# EAGLE design PCB-ENCODER3 (EAGLE 7.1.0)
SKAARHOJ 2012 Rotary Encoder Breakout Board
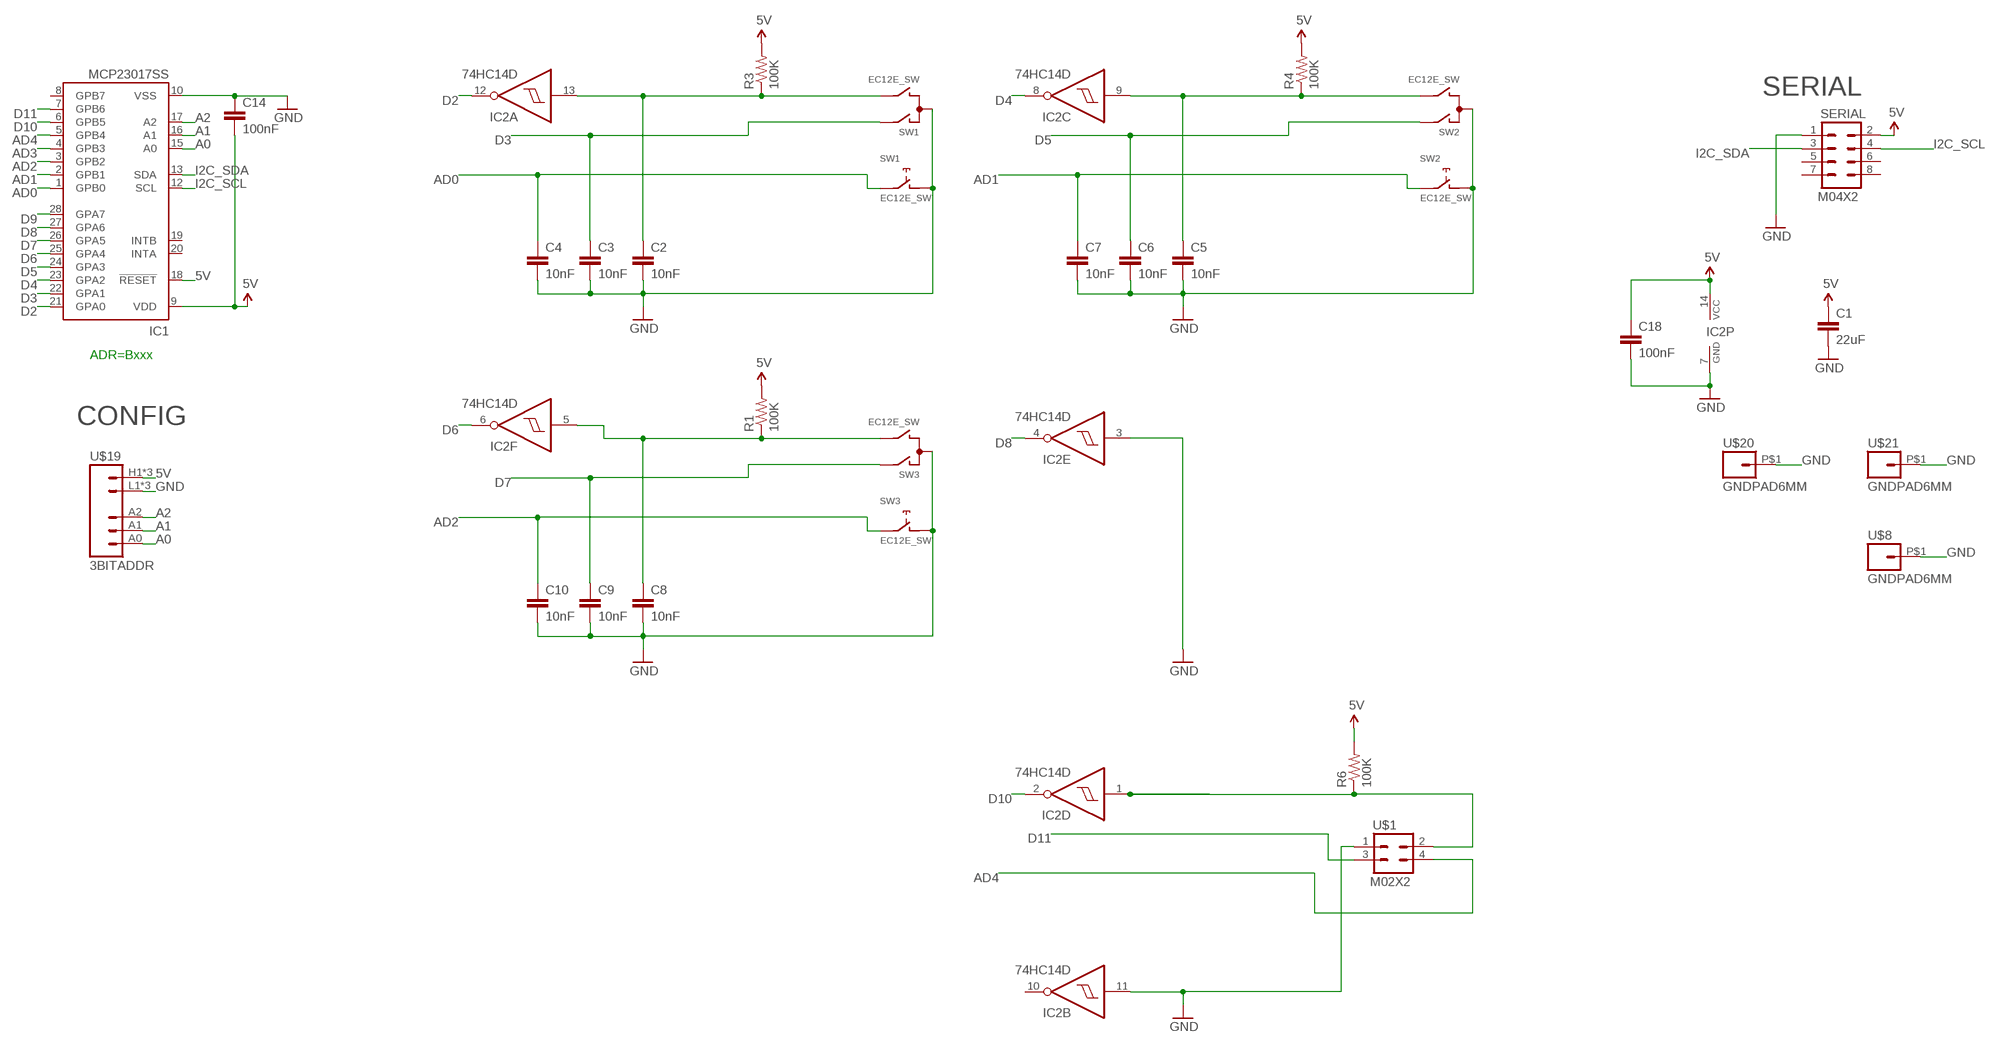
[diagram p0: schematic, sheet 1]

## Parts
C1  22uF  CAP0805  [0805]
C2  10nF  CAP0603-CAP  [0603-CAP]
C3  10nF  CAP0603-CAP  [0603-CAP]
C4  10nF  CAP0603-CAP  [0603-CAP]
C5  10nF  CAP0603-CAP  [0603-CAP]
C6  10nF  CAP0603-CAP  [0603-CAP]
C7  10nF  CAP0603-CAP  [0603-CAP]
C8  10nF  CAP0603-CAP  [0603-CAP]
C9  10nF  CAP0603-CAP  [0603-CAP]
C10  10nF  CAP0603-CAP  [0603-CAP]
C14  100nF  CAP0603-CAP  [0603-CAP]
C18  100nF  CAP0603-CAP  [0603-CAP]
IC1  MCP23017SS  [SSOP28]
IC2  74HC14D  [SO14]
R1  100K  RESISTOR0603-RES  [0603-RES]
R3  100K  RESISTOR0603-RES  [0603-RES]
R4  100K  RESISTOR0603-RES  [0603-RES]
R6  100K  RESISTOR0603-RES  [0603-RES]
SERIAL  M04X2  [2X4]
SW1  EC12E_SW  [ALPS_EC12E_SW]
SW2  EC12E_SW  [ALPS_EC12E_SW]
SW3  EC12E_SW  [ALPS_EC12E_SW]
U$1  M02X2  [2X2]
U$8  GNDPAD6MM  [3.2MMPAD6MM]
U$19  3BITADDR  [3BITADDR]
U$20  GNDPAD6MM  [3.2MMPAD6MM]
U$21  GNDPAD6MM  [3.2MMPAD6MM]

## Nets
5V [Power]: C1.1 C14.2 C18.1 IC1.9(VDD) IC1.18(!RESET) IC2.14(P:VCC) R1.2 R3.2 R4.2 R6.2 SERIAL.2 U$19.H1(VCC) U$19.H2(VCC) U$19.H3(VCC)
A0: IC1.15(A0) U$19.A0
A1: IC1.16(A1) U$19.A1
A2: IC1.17(A2) U$19.A2
AD0: C4.1 IC1.1(GPB0) SW1.E
AD1: C7.1 IC1.2(GPB1) SW2.E
AD2: C10.1 IC1.3(GPB2) SW3.E
AD3: IC1.4(GPB3)
AD4: IC1.5(GPB4) U$1.4
D2: IC1.21(GPA0) IC2.12(A:O)
D3: C3.1 IC1.22(GPA1) SW1.A
D4: IC1.23(GPA2) IC2.8(C:O)
D5: C6.1 IC1.24(GPA3) SW2.A
D6: IC1.25(GPA4) IC2.6(F:O)
D7: C9.1 IC1.26(GPA5) SW3.A
D8: IC1.27(GPA6) IC2.4(E:O)
D9: IC1.28(GPA7)
D10: IC1.6(GPB5) IC2.2(D:O)
D11: IC1.7(GPB6) U$1.3
GND [Power]: C1.2 C2.2 C3.2 C4.2 C5.2 C6.2 C7.2 C8.2 C9.2 C10.2 C14.1 C18.2 IC1.10(VSS) IC2.3(E:I) IC2.7(P:GND) IC2.11(B:I) SERIAL.1 SW1.C SW1.D SW2.C SW2.D SW3.C SW3.D U$1.1 U$8.P$1 U$19.L1(GND) U$19.L2(GND) U$19.L3(GND) U$20.P$1 U$21.P$1
I2C_SCL: IC1.12(SCL) SERIAL.4
I2C_SDA: IC1.13(SDA) SERIAL.3
N$2: IC2.1(D:I) R6.1 U$1.2
N$123: C8.1 IC2.5(F:I) R1.1 SW3.B
N$124: C2.1 IC2.13(A:I) R3.1 SW1.B
N$125: C5.1 IC2.9(C:I) R4.1 SW2.B
Unconnected: IC1.8(GPB7) IC1.19(INTB) IC1.20(INTA) IC2.10(B:O) SERIAL.5 SERIAL.6 SERIAL.7 SERIAL.8 SW1.GND1(G) SW1.GND2(G) SW2.GND1(G) SW2.GND2(G) SW3.GND1(G) SW3.GND2(G)

## Notes on the sheet
- SERIAL
- ADR=Bxxx
- CONFIG

## Library data of the parts
C1-C10 C14 C18 = SparkFun:CAP: Capacitor Standard 0603 ceramic capacitor, and 0.1" leaded capacitor.
IC1 = microchip:MCP23017: http://ww1.microchip.com/downloads/en/DeviceDoc/21952a.pdf Source: http://ww1.microchip.com/downloads/en/DeviceDoc/21952a.pdf; MF: MICROCHIP; MPN: MCP23017-E/SS; OC_FARNELL: 1467674; OC_NEWARK: 31K2960
IC2 = 74xx-eu:74*14: Hex schmitt trigger INVERTER
R1 R3 R4 R6 = SparkFun:RESISTOR: Resistor Basic schematic elements and footprints for 0603, 1206, and PTH resistors.
SERIAL = SparkFun:M04X2
SW1-SW3 = switch-alps:EC12E_SW: ALPS rotary Encoder EC12E series with switch; MPN: EC12E2424407; OC_FARNELL: 1520813; OC_NEWARK: 74M1068
U$1 = SKAARHOJ:M02X2
U$8 U$20 U$21 = SKAARHOJ:GNDPAD
U$19 = SKAARHOJ:3BITADDR

## Net classes
0 default: width 0.203 mm, drill 0.406 mm, clearance 0.203 mm
1 Power: width 0.254 mm, drill 0.406 mm, clearance 0.254 mm

## Board
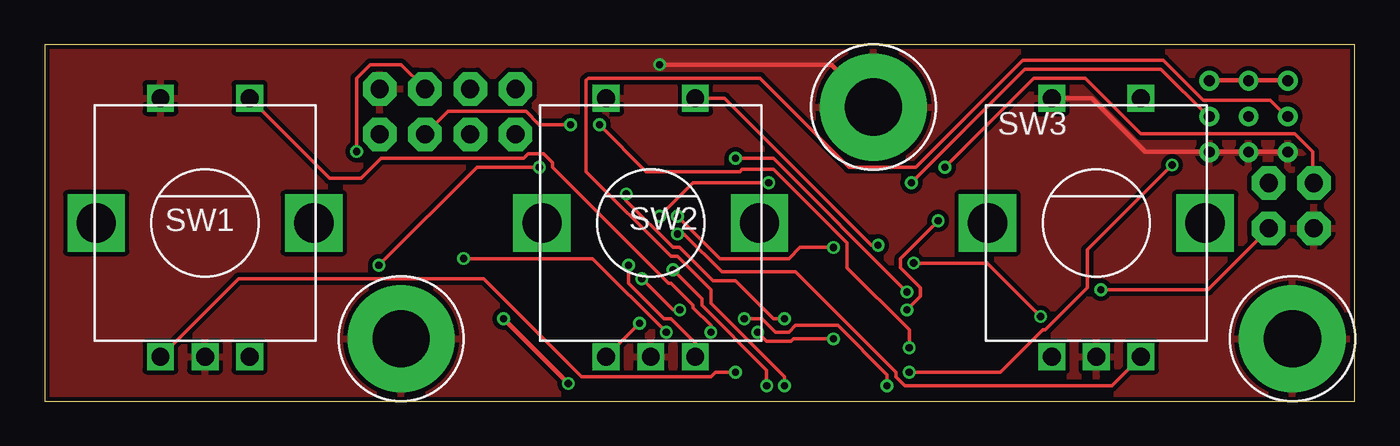
[diagram p1: board, top side]
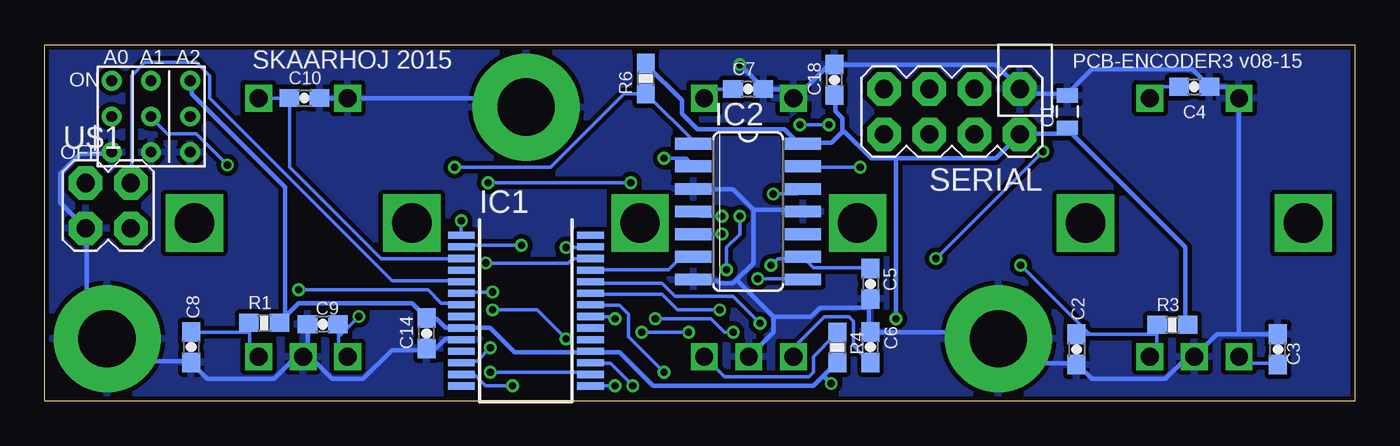
[diagram p2: board, bottom side, seen from below]

Size 73.5 x 20 mm. Coordinates in mm from the lower left corner, seen from the top.
Outline: 0,0 73.5,0 73.5,20 0,20 0,0
Copper layers (1*16): Top 0.035mm / dielectric 1.5mm / Bottom 0.035mm
Design rules "Fusion_eagle_rule_v1.1": minimum track width 6mil, minimum drill 12mil, track to track 6mil, track to pad 6mil, pad to pad 6mil, via to via 6mil, smd to smd 0mil, copper to edge 10mil, drill to drill 10mil, minimum pad ring 10mil, minimum via ring 6mil, stop-mask expansion 2mil, vias tented up to drill 100mil, thermal gap 10mil

### Footprints (pad centres in the part's own frame; a part is rotated, then mirrored left to right if it is on the bottom)
0805 = smd 0.8 x 1.2: 1 -0.9,0; 2 0.9,0
0603-CAP = smd 1.1 x 1: 1 -0.85,0; 2 0.85,0
SSOP28 = smd 0.4 x 1.5: 1 -4.225,-3.625; 2 -3.575,-3.625; 3 -2.925,-3.625; 4 -2.275,-3.625; 5 -1.625,-3.625; 6 -0.975,-3.625; 7 -0.325,-3.625; 8 0.325,-3.625; 9 0.975,-3.625; 10 1.625,-3.625; 11 2.275,-3.625; 12 2.925,-3.625; 13 3.575,-3.625; 14 4.225,-3.625; 15 4.225,3.625; 16 3.575,3.625; 17 2.925,3.625; 18 2.275,3.625; 19 1.625,3.625; 20 0.975,3.625; 21 0.325,3.625; 22 -0.325,3.625; 23 -0.975,3.625; 24 -1.625,3.625; 25 -2.275,3.625; 26 -2.925,3.625; 27 -3.575,3.625; 28 -4.225,3.625
SO14 = smd 0.66 x 2.032: 1 -3.81,-3.073; 2 -2.54,-3.073; 3 -1.27,-3.073; 4 0,-3.073; 5 1.27,-3.073; 6 2.54,-3.073; 7 3.81,-3.073; 8 3.81,3.073; 9 2.54,3.073; 10 1.27,3.073; 11 0,3.073; 12 -1.27,3.073; 13 -2.54,3.073; 14 -3.81,3.073
0603-RES = smd 1.1 x 1: 1 -0.85,0; 2 0.85,0
2X4 = drill 1.016 pad 1.88 octagon: 1 -3.81,-1.27; 2 -3.81,1.27; 3 -1.27,-1.27; 4 -1.27,1.27; 5 1.27,-1.27; 6 1.27,1.27; 7 3.81,-1.27; 8 3.81,1.27
ALPS_EC12E_SW = drill 1 square: A -2.5,-7.5; B 2.5,-7.5; C 0,-7.5; D -2.5,7; E 2.5,7 | drill 2.2 square: GND1 -6.1,0; GND2 6.1,0
2X2 = drill 1.016 pad 1.88 octagon: 1 -3.81,-1.27; 2 -3.81,1.27; 3 -1.27,-1.27; 4 -1.27,1.27
3.2MMPAD6MM = drill 3.2 pad 6: P$1 0,0
3BITADDR = drill 0.6: A0 -2.2,0; A1 0,0; A2 2.2,0; H1 -2.2,2; H2 0,2; H3 2.2,2; L1 -2.2,-2; L2 0,-2; L3 2.2,-2

### Placement (x,y rotation side)
C1  16.13,16.24 90 bottom
C2  15.62,2.9 270 bottom
C3  4.32,2.9 90 bottom
C4  9.02,17.64 0 bottom
C5  27.18,6.59 270 bottom
C6  27.18,3.03 90 bottom
C7  34.04,17.51 0 bottom
C8  65.28,3.03 270 bottom
C9  57.9,4.32 180 bottom
C10  58.93,17 0 bottom
C14  52.07,3.81 90 bottom
C18  29.19,18.03 90 bottom
IC1  46.5,5.08 270 bottom
IC2  34.04,10.64 270 bottom
R1  61.18,4.4 0 bottom
R3  10.24,4.29 0 bottom
R4  29.03,3.02 270 bottom
R6  39.78,18.1 90 bottom
SERIAL  22.61,16.24 180 bottom
SW1  9,10 0 top
SW2  34,10 0 top
SW3  59,10 0 top
U$1  67.39,10.97 0 bottom
U$8  46.5,16.5 0 top
U$19  67.53,15.97 0 bottom
U$20  20,3.5 0 top
U$21  70,3.5 0 top

### Tracks (layer width: path | path; a pad name or v marks a point on that pad's centre or on a via)
5V  (via drill 0.41)
  Top 0.254: U$19.H3 65.38,18 67.5,18 U$19.H2 67.62,18 69.62,18 U$19.H1 | v29.38,1 v25.75,4.62
  Bottom 0.254: 28.75,15.12 28.75,15.88 29.12,16.25 29.12,17.12 C18.1 | 28.75,15.12 29.38,14.5 30.88,14.5 IC2.14 31,14.5 31.25,14.5 32,15.25 36.88,15.25 37.75,16.12 37.75,16.88 39.75,18.88 R6.2 | R3.2 9.5,4.38 9.5,8.62 16.12,15.25 C1.1 16,15 18.75,15 SERIAL.2 18.88,14.88 20.12,13.62 25.75,13.62 | 25.75,13.62 27.12,13.62 28.62,15.12 28.75,15.12 | 29.81,1.44 30.38,0.88 39.38,0.88 41.25,2.75 42.88,2.75 IC1.18 43,2.75 47.12,2.75 48.5,4.12 50,4.12 IC1.9 50.12,4.12 51,4.12 51.5,4.62 52,4.62 C14.2 52.12,4.75 52.88,5.5 59.25,5.5 60.25,4.5 R1.2 60,4.88 60,12 65.25,17.25 65.25,17.88 U$19.H3 | 29.81,1.44 29.12,2.12 R4.2 | v25.75,4.62 25.75,13.62 | 29.81,1.44 v29.38,1
A0  (via drill 0.41)
  Top 0.203: v41.5,0.88 41.5,1.38 37.38,5.5 37.38,6.25 35.5,8.12 35.12,8.12 30.38,12.88 30.38,18 30.5,18.12 40.12,18.12 45.12,13.12 48.88,13.12 54.88,19.12 62.75,19.12 65,16.88 68.75,16.88 69.62,16 U$19.A0
  Bottom 0.203: v41.5,0.88 42.88,0.88 IC1.15
A1  (via drill 0.41)
  Top 0.203: v48.5,1.62 53.62,1.62 56,4 56.12,4 58.5,6.38 58.5,8.5 v63.25,13.25
  Bottom 0.203: v48.5,1.62 42.88,1.62 IC1.16 | v63.25,13.25 65,15 66.62,15 67.5,15.88 U$19.A1
A2  (via drill 0.41)
  Top 0.203: v40.5,0.88 40.5,1.75 36.88,5.38 36.88,5.75 v35.25,7.38 | v34.5,10.38 36.38,12.25 v40.62,12.25 | v48.62,12.25 55,18.62 62.62,18.62 65.25,16 U$19.A2
  Bottom 0.203: v40.5,0.88 41.75,2.12 42.88,2.12 IC1.17 | v35.25,7.38 35.25,8.62 34.5,9.38 v34.5,10.38 | v48.62,12.25 v40.62,12.25
AD0  (via drill 0.41)
  Top 0.203: v50.12,10.12 48,8 48,7.5 49.12,6.38 49.12,5.88 v48.38,5.12 | v44.25,3.5 42,3.5 41.88,3.38 40.5,3.38 v40,3.88 | v37.38,3.88 37.38,4.25 36.38,5.25 36.38,5.38 35.12,6.62 35,6.62 28.5,13.12 28.5,13.38 28,13.88 27.12,13.88 26.88,13.62 18.88,13.62 17.75,12.5 16,12.5 SW1.E
  Bottom 0.203: SW1.E 10.88,17.62 9.88,17.62 C4.1 | v50.12,10.12 IC1.1 | v48.38,5.12 45.88,5.12 v44.25,3.5 | v37.38,3.88 v40,3.88
AD1  (via drill 0.41)
  Top 0.203: v46.75,8.75 46.38,8.75 38.12,17 SW2.E
  Bottom 0.203: SW2.E 36,17.5 35,17.5 C7.1 | v46.75,8.75 50.12,8.75 IC1.2
AD2
  Bottom 0.203: SW3.E 59.88,17 C10.1 59.75,17 59.75,13.12 54.62,8 IC1.3
AD4
  Bottom 0.203: IC1.5 50.12,6.75 54,6.75 64.25,17 64.25,18.25 65,19 67.88,19 68.62,18.25 68.62,12.25 U$1.4
D2  (via drill 0.41)
  Top 0.203: v41.5,4.62 40.88,4.62 38.75,6.75 37.5,6.75 35.62,8.62 35.25,8.62 32.62,11.25 v32.62,11.62
  Bottom 0.203: v41.5,4.62 41.62,4.75 IC1.21 | v32.62,11.62 31.25,11.62 31,11.88 IC2.12
D3  (via drill 0.41)
  Top 0.203: v38.75,1.62 37.62,1.62 37.38,1.38 30.12,1.38 24.62,6.88 10.88,6.88 SW1.A
  Bottom 0.203: SW1.A 6.12,2.12 4.38,2.12 C3.1 | v38.75,1.62 40.75,3.62 40.75,4.88 41.25,5.38 42.88,5.38 IC1.22
D4  (via drill 0.41)
  Top 0.203: v35.62,5.12 35.25,5.12 v33.5,6.88
  Bottom 0.203: v35.62,5.12 38,5.12 38.88,6 42.88,6 IC1.23 | v33.5,6.88 31,6.88 IC2.8
D5  (via drill 0.41)
  Top 0.203: SW2.A v33.38,4.38
  Bottom 0.203: SW2.A 31.5,3 29.75,4.75 28.38,4.75 28.12,4.5 28.12,3.12 27.25,2.25 C6.1 | v33.38,4.38 34.88,5.88 38.12,5.88 38.88,6.62 42.88,6.62 IC1.24
D6
  Bottom 0.203: IC1.25 42.88,7.38 38.5,7.38 37.88,8 37.12,8 IC2.6
D7  (via drill 0.41)
  Top 0.203: v48.75,7.75 52.88,7.75 v55.88,4.75
  Bottom 0.203: 57,3.62 57,3 SW3.A | 57,3.62 57,4.25 C9.1 | v48.75,7.75 44.12,7.75 43.88,8 IC1.26 | 57,3.62 v55.88,4.75
D8  (via drill 0.41)
  Top 0.203: v44.25,8.62 42.38,8.62 41.75,8 37.88,8 v35.5,10.38
  Bottom 0.203: v44.25,8.62 42.88,8.62 IC1.27 | v35.5,10.38 36.75,10.38 37,10.62 IC2.4
D10  (via drill 0.41)
  Top 0.203: v48.38,6.12 40.88,13.62 v38.75,13.62
  Bottom 0.203: v48.38,6.12 50.12,6.12 IC1.6 | v38.75,13.62 37.5,13.62 37.12,13.25 IC2.2
D11  (via drill 0.41)
  Top 0.203: v59.25,6.25 65.25,6.25 68.62,9.62 U$1.3
  Bottom 0.203: v59.25,6.25 52,6.25 51.25,5.5 50.12,5.5 IC1.7
GND  (via drill 0.41)
  Top 0.254: U$19.L1 69.62,14 67.62,14 U$19.L2 67.5,14 65.38,14 U$19.L3 65.25,14 61.75,14 58.75,17 SW3.D | v34.5,18.88 44.12,18.88 U$8.P$1
  Bottom 0.254: 37.12,6.88 IC2.7 37,6.75 35.75,6.75 35.62,6.62 34.88,6.62 34.69,6.81 | 33.75,10.75 31,10.75 IC2.11 | 33.75,10.75 34.88,11.88 37,11.88 IC2.3 | 34.69,6.81 33.75,7.75 33.75,10.75 | SW2.C 32.62,3.88 32.62,4.75 | 34.69,6.81 32.62,4.75 | 6.5,3.75 7.75,3.75 SW1.C 9.38,2.5 10.62,1.25 14.75,1.25 15.5,2 C2.2 15.62,2.12 18.62,2.12 U$20.P$1 20.12,3.5 20.5,3.88 27.12,3.88 C6.2 27.25,4 27.25,5.62 C5.2 27.38,5.25 30,5.25 30.5,4.75 32.62,4.75 | 6.5,3.75 4.38,3.75 C3.2 | 6.5,3.75 SW1.D 7.12,17.62 8.12,17.62 C4.2 8.25,17.75 9.12,18.62 14.75,18.62 16.12,17.25 C1.2 16.25,17.25 18.5,17.25 18.75,17.5 SERIAL.1 18.88,17.62 20.12,18.88 29.12,18.88 C18.2 29.25,18.88 29.5,18.88 31.38,17 SW2.D 32,17.5 33.12,17.5 C7.2 33.25,17.62 v34.5,18.88 | C10.2 58,17 SW3.D 47,17 U$8.P$1 | U$19.L1 69.75,13.88 71.5,13.88 72.62,12.75 72.62,11.12 U$1.1 71.12,9.62 71.12,4.75 70,3.62 U$21.P$1 68.75,2.25 65.38,2.25 C8.2 65.25,2.12 64.38,1.25 60.62,1.25 59.38,2.5 SW3.C | IC1.10 50.12,3.5 51,3.5 51.5,3 52,3 C14.1 52.12,2.88 54,2.88 55.62,1.25 57.38,1.25 58.75,2.62 SW3.C | SW3.C 58.75,2.75 58.75,4.25 C9.2
  pour Top: 0,0 74,0 74,20 0,20
  pour Bottom: 0,0 74,0 74,20 0,20
I2C_SCL  (via drill 0.41)
  Top 0.203: v48.5,3 48.5,4 45,7.5 45,8.88 40.88,13 39.12,13 39,12.88 33.75,12.88 v31.12,15.5 | v29.5,15.5 27.75,15.5 27,16.25 22.62,16.25 21.38,15 SERIAL.4
  Bottom 0.203: v48.5,3 49.25,2.25 50.12,2.25 IC1.12 | v29.5,15.5 v31.12,15.5
I2C_SDA  (via drill 0.41)
  Top 0.203: v47.25,0.88 47.25,1.5 44.5,4.25 42.12,4.25 41.75,3.88 41,3.88 40.25,4.62 v39.25,4.62 | v34.88,3.88 30.75,8 v23.5,8 | v17.5,14 17.5,18.12 18.25,18.88 20,18.88 21.25,17.62 SERIAL.3
  Bottom 0.203: v47.25,0.88 48.75,0.88 49.38,1.5 IC1.13 | v39.25,4.62 36.12,4.62 35.38,3.88 v34.88,3.88 | v17.5,14 v23.5,8
N$2  (via drill 0.41)
  Top 0.203: v50.5,13.12 55.5,18.12 58.38,18.12 61.5,15 70.12,15 71.12,14 71.12,12.25 U$1.2
  Bottom 0.203: IC2.1 37,14.5 39.75,17.25 R6.1 41,17.25 45.12,13.12 v50.5,13.12
N$123  (via drill 0.41)
  Top 0.203: v35.5,9.38 35.88,9.38 38,7.25 42.12,7.25 47.75,1.62 47.75,1.38 48.25,0.88 59.88,0.88 SW3.B
  Bottom 0.203: 62,3.88 62,3 SW3.B | 62,3.88 62,4.38 R1.1 | 62,3.88 65.25,3.88 C8.1 | v35.5,9.38 37,9.38 IC2.5
N$124  (via drill 0.41)
  Top 0.203: v27.75,13.12 24.25,13.12 v18.75,7.62
  Bottom 0.203: 11.12,3.75 11.12,2.88 SW1.B | 11.12,3.75 11.12,4.25 R3.1 | 11.12,3.75 14.88,3.75 | 14.88,3.75 15.5,3.75 C2.1 | v27.75,13.12 30.88,13.12 IC2.13 | 14.88,3.75 v18.75,7.62
N$125  (via drill 0.41)
  Top 0.203: v32.75,7.62 32.75,6.62 34.75,4.62 35.12,4.62 36.5,3.25 SW2.B
  Bottom 0.203: C5.1 27.25,7.5 30.38,7.5 30.88,8 IC2.9 31,8 32.38,8 v32.75,7.62 | SW2.B 35.38,1.38 30.62,1.38 30.38,1.62 30.38,2.5 29.12,3.75 R4.1

### Text on the board
_bsilk: PCB-ENCODER3 v08-15 | SKAARHOJ 2015